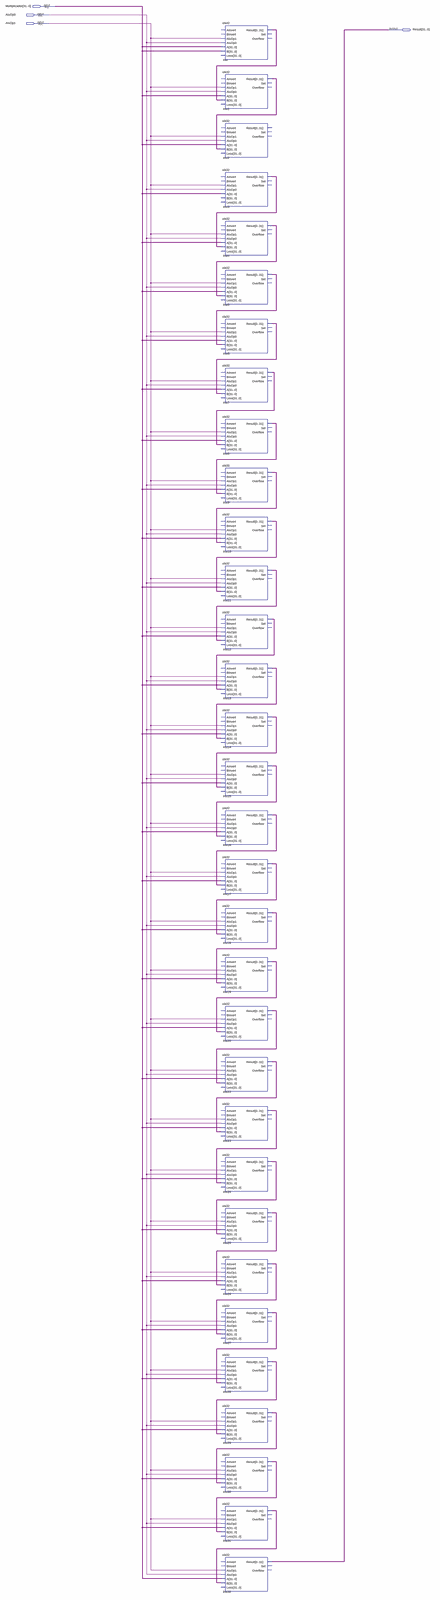
[diagram p0: schematic sheet, whole]
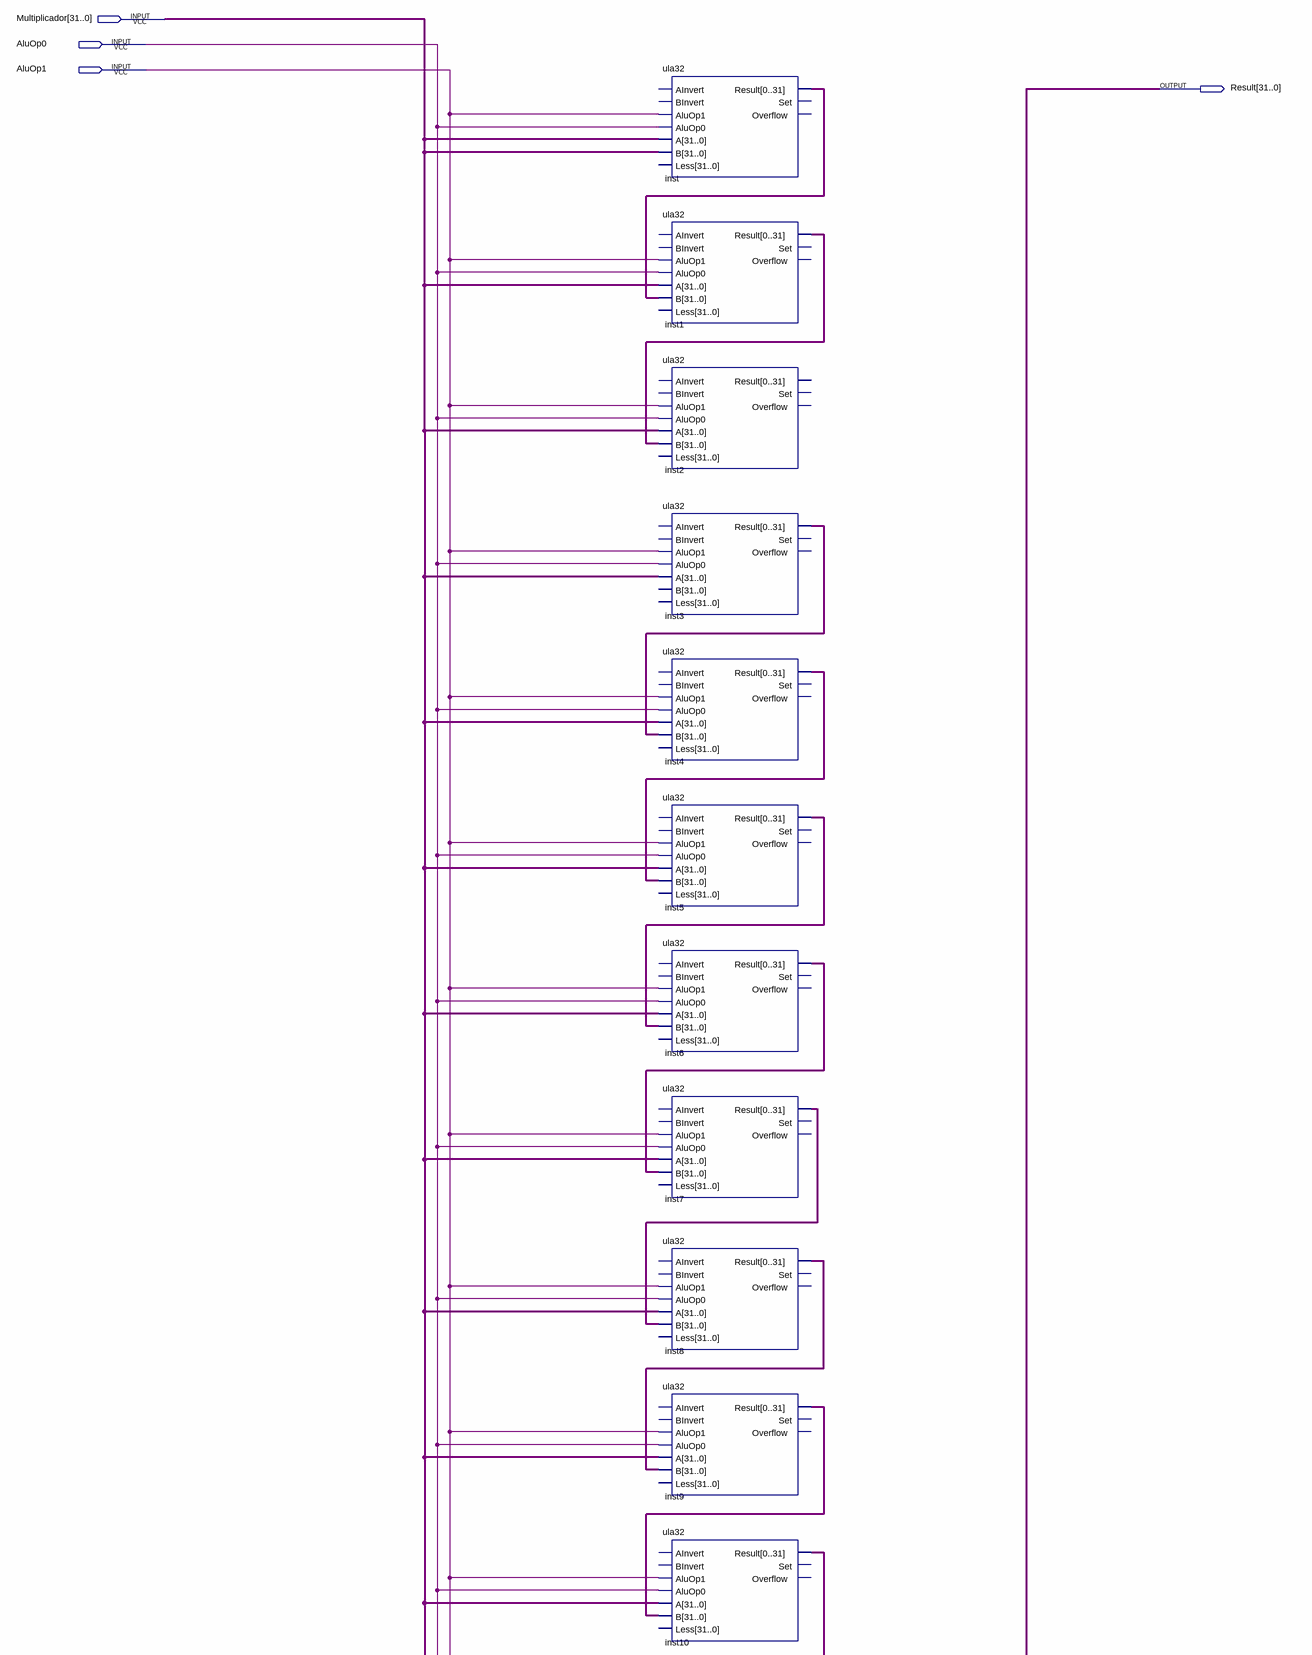
[diagram p1: schematic sheet, upper part]
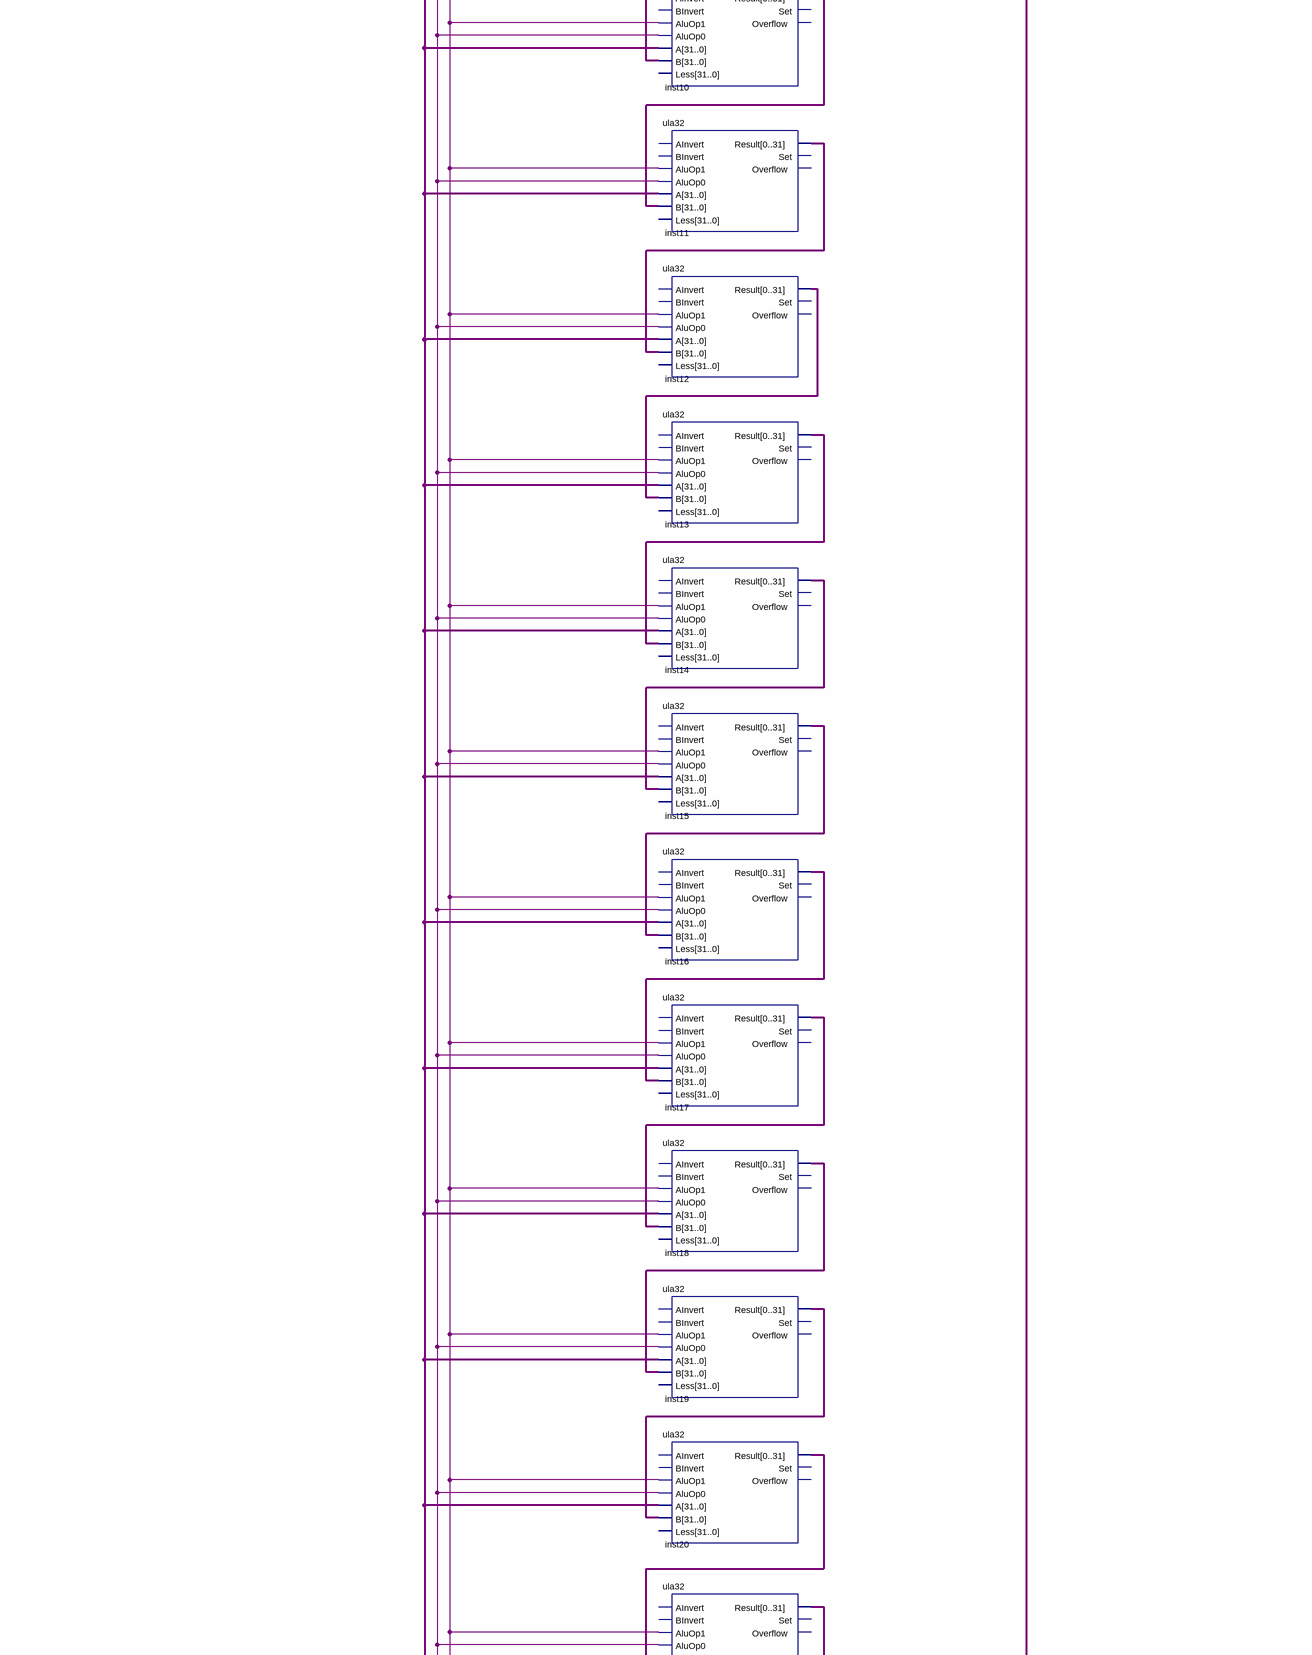
[diagram p2: schematic sheet, middle part]
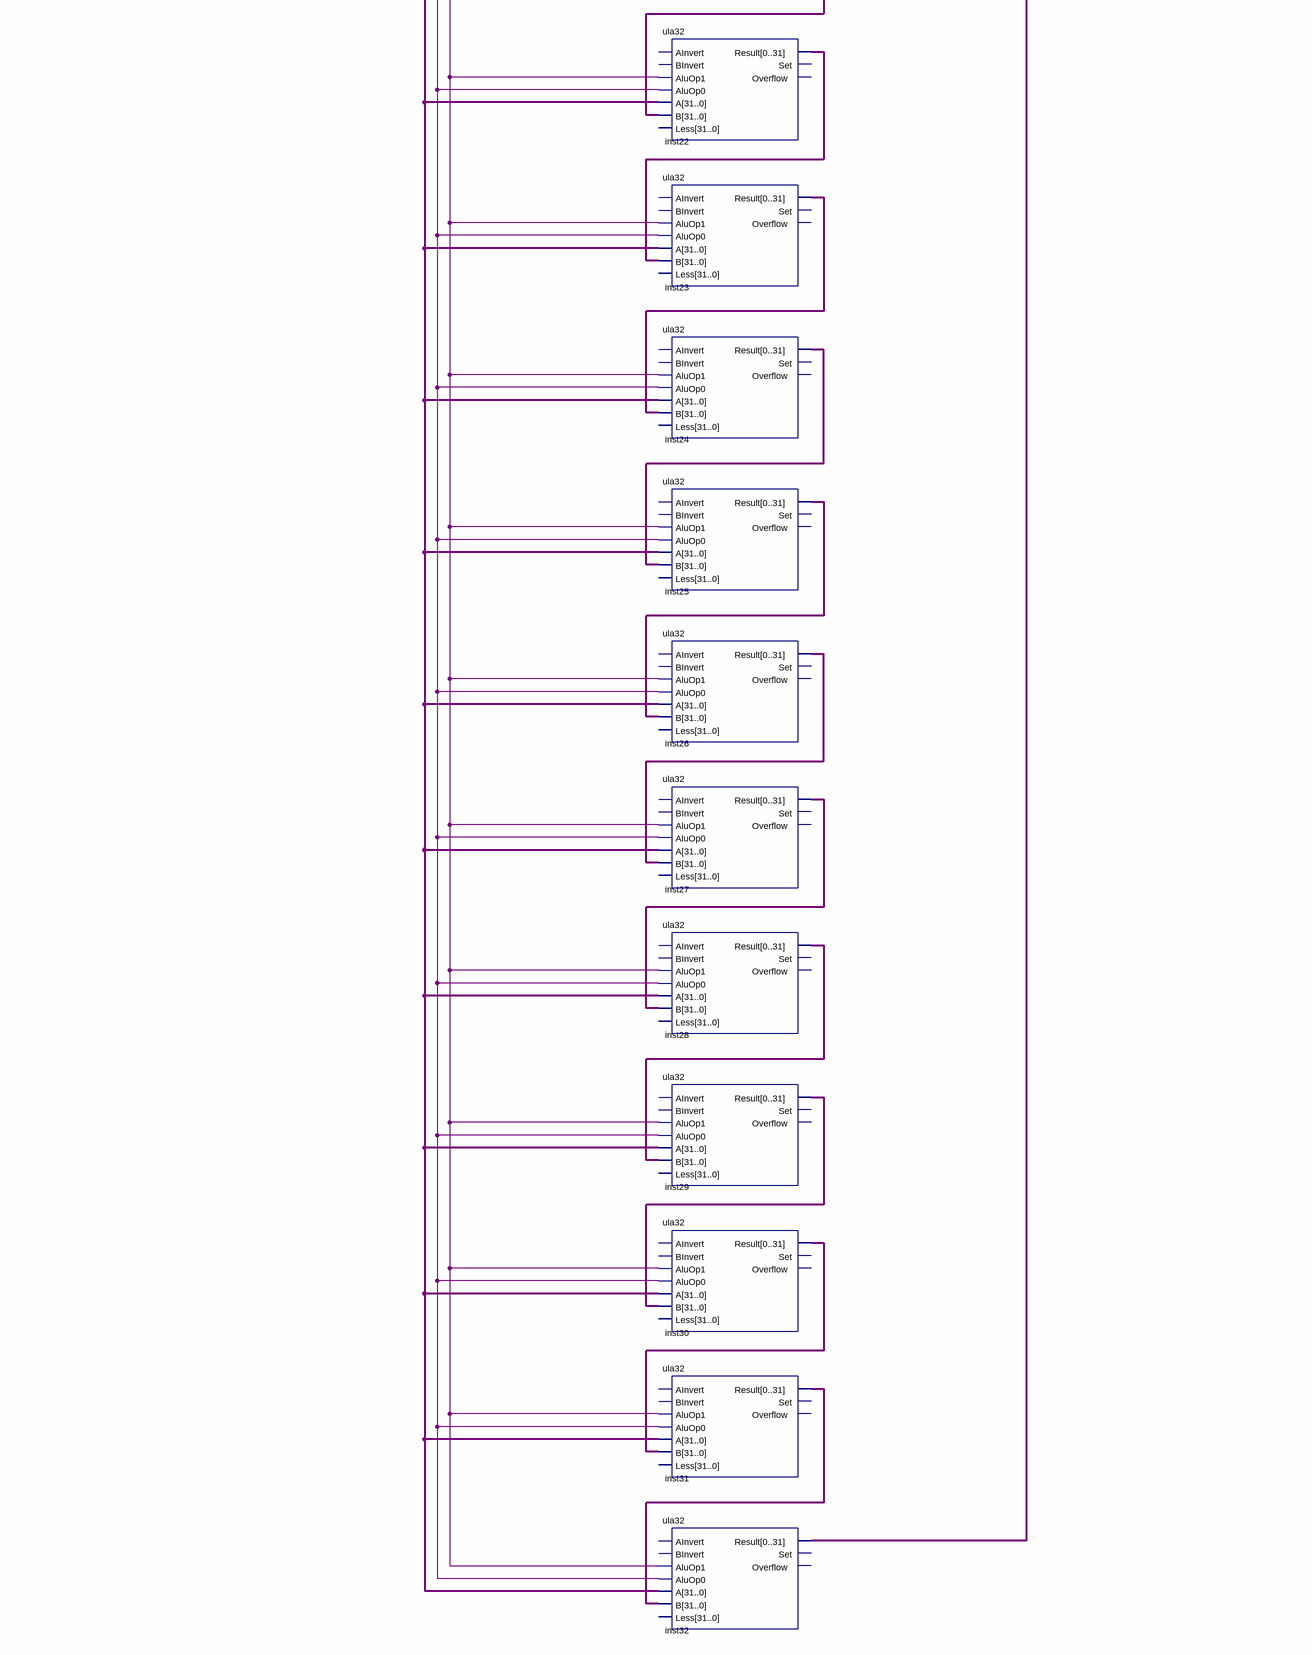
[diagram p3: schematic sheet, lower part]
// Quartus schematic mult32.bdf as structural Verilog: 32 symbols, 4 pins
module mult32 (
  input  [31:0] Multiplicador,
  input  AluOp0,
  input  AluOp1,
  output [31:0] Result
);

  wire [31:0] inst1_result, inst3_result, inst4_result, inst5_result, inst6_result, inst7_result,
       inst8_result, inst9_result, inst10_result, inst11_result, inst12_result, inst13_result, inst14_result,
       inst15_result, inst16_result, inst17_result, inst18_result, inst19_result, inst20_result,
       inst22_result, inst23_result, inst24_result, inst25_result, inst26_result, inst27_result,
       inst28_result, inst29_result, inst30_result, inst31_result, inst_result;

  ula32 inst (
    .AluOp1(AluOp1), .AluOp0(AluOp0), .A(Multiplicador), .B(Multiplicador), .Result(inst_result));  // open: AInvert, BInvert, Less, Set, Overflow
  ula32 inst1 (
    .AluOp1(AluOp1), .AluOp0(AluOp0), .A(Multiplicador), .B(inst_result), .Result(inst1_result));  // open: AInvert, BInvert, Less, Set, Overflow
  ula32 inst2 (
    .AluOp1(AluOp1), .AluOp0(AluOp0), .A(Multiplicador), .B(inst1_result));  // open: AInvert, BInvert, Less, Result, Set, Overflow
  ula32 inst3 (
    .AluOp1(AluOp1), .AluOp0(AluOp0), .A(Multiplicador), .Result(inst3_result));  // open: AInvert, BInvert, B, Less, Set, Overflow
  ula32 inst4 (
    .AluOp1(AluOp1), .AluOp0(AluOp0), .A(Multiplicador), .B(inst3_result), .Result(inst4_result));  // open: AInvert, BInvert, Less, Set, Overflow
  ula32 inst5 (
    .AluOp1(AluOp1), .AluOp0(AluOp0), .A(Multiplicador), .B(inst4_result), .Result(inst5_result));  // open: AInvert, BInvert, Less, Set, Overflow
  ula32 inst6 (
    .AluOp1(AluOp1), .AluOp0(AluOp0), .A(Multiplicador), .B(inst5_result), .Result(inst6_result));  // open: AInvert, BInvert, Less, Set, Overflow
  ula32 inst7 (
    .AluOp1(AluOp1), .AluOp0(AluOp0), .A(Multiplicador), .B(inst6_result), .Result(inst7_result));  // open: AInvert, BInvert, Less, Set, Overflow
  ula32 inst8 (
    .AluOp1(AluOp1), .AluOp0(AluOp0), .A(Multiplicador), .B(inst7_result), .Result(inst8_result));  // open: AInvert, BInvert, Less, Set, Overflow
  ula32 inst9 (
    .AluOp1(AluOp1), .AluOp0(AluOp0), .A(Multiplicador), .B(inst8_result), .Result(inst9_result));  // open: AInvert, BInvert, Less, Set, Overflow
  ula32 inst10 (
    .AluOp1(AluOp1), .AluOp0(AluOp0), .A(Multiplicador), .B(inst9_result), .Result(inst10_result));  // open: AInvert, BInvert, Less, Set, Overflow
  ula32 inst11 (
    .AluOp1(AluOp1), .AluOp0(AluOp0), .A(Multiplicador), .B(inst10_result), .Result(inst11_result));  // open: AInvert, BInvert, Less, Set, Overflow
  ula32 inst12 (
    .AluOp1(AluOp1), .AluOp0(AluOp0), .A(Multiplicador), .B(inst11_result), .Result(inst12_result));  // open: AInvert, BInvert, Less, Set, Overflow
  ula32 inst13 (
    .AluOp1(AluOp1), .AluOp0(AluOp0), .A(Multiplicador), .B(inst12_result), .Result(inst13_result));  // open: AInvert, BInvert, Less, Set, Overflow
  ula32 inst14 (
    .AluOp1(AluOp1), .AluOp0(AluOp0), .A(Multiplicador), .B(inst13_result), .Result(inst14_result));  // open: AInvert, BInvert, Less, Set, Overflow
  ula32 inst15 (
    .AluOp1(AluOp1), .AluOp0(AluOp0), .A(Multiplicador), .B(inst14_result), .Result(inst15_result));  // open: AInvert, BInvert, Less, Set, Overflow
  ula32 inst16 (
    .AluOp1(AluOp1), .AluOp0(AluOp0), .A(Multiplicador), .B(inst15_result), .Result(inst16_result));  // open: AInvert, BInvert, Less, Set, Overflow
  ula32 inst17 (
    .AluOp1(AluOp1), .AluOp0(AluOp0), .A(Multiplicador), .B(inst16_result), .Result(inst17_result));  // open: AInvert, BInvert, Less, Set, Overflow
  ula32 inst18 (
    .AluOp1(AluOp1), .AluOp0(AluOp0), .A(Multiplicador), .B(inst17_result), .Result(inst18_result));  // open: AInvert, BInvert, Less, Set, Overflow
  ula32 inst19 (
    .AluOp1(AluOp1), .AluOp0(AluOp0), .A(Multiplicador), .B(inst18_result), .Result(inst19_result));  // open: AInvert, BInvert, Less, Set, Overflow
  ula32 inst20 (
    .AluOp1(AluOp1), .AluOp0(AluOp0), .A(Multiplicador), .B(inst19_result), .Result(inst20_result));  // open: AInvert, BInvert, Less, Set, Overflow
  ula32 inst22 (
    .AluOp1(AluOp1), .AluOp0(AluOp0), .A(Multiplicador), .B(inst20_result), .Result(inst22_result));  // open: AInvert, BInvert, Less, Set, Overflow
  ula32 inst23 (
    .AluOp1(AluOp1), .AluOp0(AluOp0), .A(Multiplicador), .B(inst22_result), .Result(inst23_result));  // open: AInvert, BInvert, Less, Set, Overflow
  ula32 inst24 (
    .AluOp1(AluOp1), .AluOp0(AluOp0), .A(Multiplicador), .B(inst23_result), .Result(inst24_result));  // open: AInvert, BInvert, Less, Set, Overflow
  ula32 inst25 (
    .AluOp1(AluOp1), .AluOp0(AluOp0), .A(Multiplicador), .B(inst24_result), .Result(inst25_result));  // open: AInvert, BInvert, Less, Set, Overflow
  ula32 inst26 (
    .AluOp1(AluOp1), .AluOp0(AluOp0), .A(Multiplicador), .B(inst25_result), .Result(inst26_result));  // open: AInvert, BInvert, Less, Set, Overflow
  ula32 inst27 (
    .AluOp1(AluOp1), .AluOp0(AluOp0), .A(Multiplicador), .B(inst26_result), .Result(inst27_result));  // open: AInvert, BInvert, Less, Set, Overflow
  ula32 inst28 (
    .AluOp1(AluOp1), .AluOp0(AluOp0), .A(Multiplicador), .B(inst27_result), .Result(inst28_result));  // open: AInvert, BInvert, Less, Set, Overflow
  ula32 inst29 (
    .AluOp1(AluOp1), .AluOp0(AluOp0), .A(Multiplicador), .B(inst28_result), .Result(inst29_result));  // open: AInvert, BInvert, Less, Set, Overflow
  ula32 inst30 (
    .AluOp1(AluOp1), .AluOp0(AluOp0), .A(Multiplicador), .B(inst29_result), .Result(inst30_result));  // open: AInvert, BInvert, Less, Set, Overflow
  ula32 inst31 (
    .AluOp1(AluOp1), .AluOp0(AluOp0), .A(Multiplicador), .B(inst30_result), .Result(inst31_result));  // open: AInvert, BInvert, Less, Set, Overflow
  ula32 inst32 (
    .AluOp1(AluOp1), .AluOp0(AluOp0), .A(Multiplicador), .B(inst31_result), .Result(Result));  // open: AInvert, BInvert, Less, Set, Overflow
endmodule
